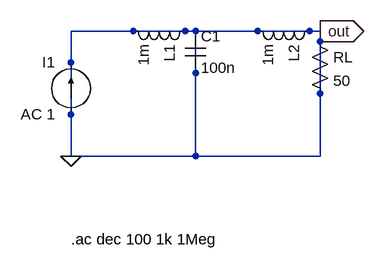
[diagram p0: schematic test_t_filter.asc]
test_t_filter.asc, the LTspice schematic file:
Version 4
SHEET 1 1800 680
WIRE 0 192 0 384
WIRE 0 192 96 192
WIRE 96 192 192 192
WIRE 192 192 192 256
WIRE 192 256 192 384
WIRE 192 192 288 192
WIRE 288 192 384 192
WIRE 384 192 384 256
WIRE 384 256 384 384
WIRE 384 384 192 384
WIRE 192 384 0 384
FLAG 0 384 0
FLAG 384 192 out
IOPIN 384 192 Out
SYMBOL current 0 320 R180
WINDOW 0 24 80 Left 2
WINDOW 3 24 0 Left 2
SYMATTR InstName I1
SYMATTR Value AC 1
SYMBOL ind 192 176 R90
SYMATTR InstName L1
SYMATTR Value 1m
SYMBOL cap 176 192 R0
SYMATTR InstName C1
SYMATTR Value 100n
SYMBOL ind 384 176 R90
SYMATTR InstName L2
SYMATTR Value 1m
SYMBOL res 368 192 R0
SYMATTR InstName RL
SYMATTR Value 50
TEXT 0 512 Left 2 !.ac dec 100 1k 1Meg

The netlist it stands for:
* test_t_filter.asc
I1 0 0 AC 1
L1 0 0 1m
C1 0 0 100n
L2 0 0 1m
RL 0 0 50
.ac dec 100 1k 1Meg
.backanno
.end